# EAGLE schematic esplash (EAGLE 9.2.2)
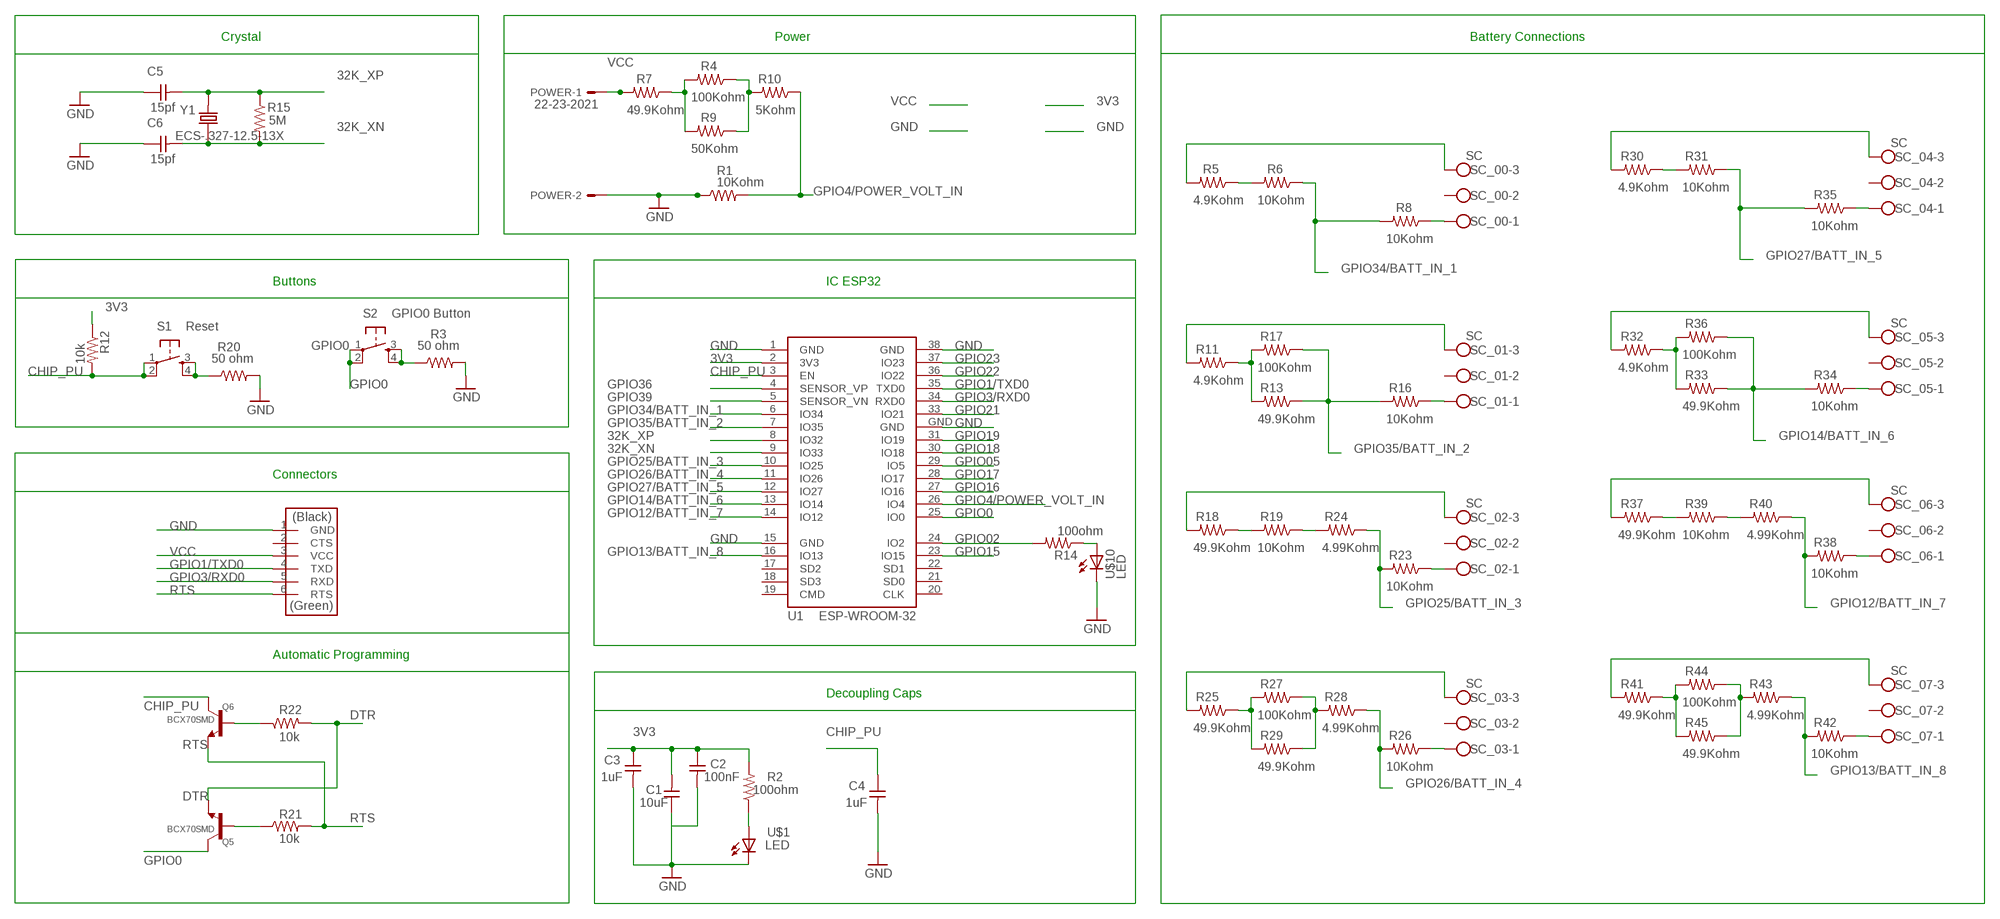
[diagram p0: schematic, sheet 1]

## Parts
C1  10uF  CAP-UNPOLARIZEDFAB  [C1206FAB]
C2  100nF  CAP-UNPOLARIZEDFAB  [C1206FAB]
C3  1uF  CAP-UNPOLARIZEDFAB  [C1206FAB]
C4  1uF  CAP-UNPOLARIZEDFAB  [C1206FAB]
C5  15pf  CAP-UNPOLARIZEDFAB  [C1206FAB]
C6  15pf  CAP-UNPOLARIZEDFAB  [C1206FAB]
POWER  22-23-2021  [22-23-2021]
Q5  BCX70SMD  [SOT23]
Q6  BCX70SMD  [SOT23]
R1  10Kohm  RES-US1206FAB  [R1206FAB]
R2  100ohm  RES-US1206  [R1206]
R3  50 ohm  RES-US1206  [R1206]
R4  100Kohm  RES-US1206FAB  [R1206FAB]
R5  4.9Kohm  RES-US1206FAB  [R1206FAB]
R6  10Kohm  RES-US1206FAB  [R1206FAB]
R7  49.9Kohm  RES-US1206FAB  [R1206FAB]
R8  10Kohm  RES-US1206FAB  [R1206FAB]
R9  50Kohm  RES-US1206FAB  [R1206FAB]
R10  5Kohm  RES-US1206FAB  [R1206FAB]
R11  4.9Kohm  RES-US1206FAB  [R1206FAB]
R12  10k  RES-US1206  [R1206]
R13  49.9Kohm  RES-US1206FAB  [R1206FAB]
R14  100ohm  RES-US1206  [R1206]
R15  5M  RES-US1206  [R1206]
R16  10Kohm  RES-US1206FAB  [R1206FAB]
R17  100Kohm  RES-US1206FAB  [R1206FAB]
R18  49.9Kohm  RES-US1206FAB  [R1206FAB]
R19  10Kohm  RES-US1206FAB  [R1206FAB]
R20  50 ohm  RES-US1206  [R1206]
R21  10k  RES-US1206  [R1206]
R22  10k  RES-US1206  [R1206]
R23  10Kohm  RES-US1206FAB  [R1206FAB]
R24  4.99Kohm  RES-US1206FAB  [R1206FAB]
R25  49.9Kohm  RES-US1206FAB  [R1206FAB]
R26  10Kohm  RES-US1206FAB  [R1206FAB]
R27  100Kohm  RES-US1206FAB  [R1206FAB]
R28  4.99Kohm  RES-US1206FAB  [R1206FAB]
R29  49.9Kohm  RES-US1206FAB  [R1206FAB]
R30  4.9Kohm  RES-US1206FAB  [R1206FAB]
R31  10Kohm  RES-US1206FAB  [R1206FAB]
R32  4.9Kohm  RES-US1206FAB  [R1206FAB]
R33  49.9Kohm  RES-US1206FAB  [R1206FAB]
R34  10Kohm  RES-US1206FAB  [R1206FAB]
R35  10Kohm  RES-US1206FAB  [R1206FAB]
R36  100Kohm  RES-US1206FAB  [R1206FAB]
R37  49.9Kohm  RES-US1206FAB  [R1206FAB]
R38  10Kohm  RES-US1206FAB  [R1206FAB]
R39  10Kohm  RES-US1206FAB  [R1206FAB]
R40  4.99Kohm  RES-US1206FAB  [R1206FAB]
R41  49.9Kohm  RES-US1206FAB  [R1206FAB]
R42  10Kohm  RES-US1206FAB  [R1206FAB]
R43  4.99Kohm  RES-US1206FAB  [R1206FAB]
R44  100Kohm  RES-US1206FAB  [R1206FAB]
R45  49.9Kohm  RES-US1206FAB  [R1206FAB]
RTS  FTDI-SMD-HEADER  [1X06SMD]
S1  Reset  6MM_SWITCH6MM_SWITCH  [6MM_SWITCH]
S2  GPIO0 Button  6MM_SWITCH6MM_SWITCH  [6MM_SWITCH]
SC_00  SC  W237-103  [W237-103]
SC_01  SC  W237-103  [W237-103]
SC_02  SC  W237-103  [W237-103]
SC_03  SC  W237-103  [W237-103]
SC_04  SC  W237-103  [W237-103]
SC_05  SC  W237-103  [W237-103]
SC_06  SC  W237-103  [W237-103]
SC_07  SC  W237-103  [W237-103]
U1  ESP-WROOM-32  [ESP-WROOM-32]
U$1  LED  [LED1206]
U$10  LED  [LED1206]
Y1  ECS-.327-12.5-13X  [XTAL_ECS-.327-12.5-13X]

## Nets
3V3: C1.2 C2.1 C3.1 R2.2 R12.1 U1.2(3V3)
32K_XN: C6.2 R15.2 U1.9(IO33) Y1.1
32K_XP: C5.2 R15.1 U1.8(IO32) Y1.2
BUT_CHIP_LO: R20.1 S1.3(S) S1.4(S1)
BUT_IO0_LO: R3.1 S2.3(S) S2.4(S1)
CHIP_PU: C4.1 Q6.3(C) R12.2 S1.1(P) S1.2(P1) U1.3(EN)
DTR: Q5.2(E) R22.2
GND: C1.1 C2.2 C3.2 C4.2 C5.1 C6.1 POWER.2 R1.1 R3.2 R20.2 RTS.1(GND) U1.1(GND) U1.15(GND) U1.38(GND) U1.GND U$1.2(C) U$10.2(C)
GPIO0: Q5.3(C) S2.1(P) S2.2(P1) U1.25(IO0)
GPIO1/TXD0: RTS.4(TXD) U1.35(TXD0)
GPIO02: R14.2 U1.24(IO2)
GPIO3/RXD0: RTS.5(RXD) U1.34(RXD0)
GPIO4/POWER_VOLT_IN: R1.2 R10.1 U1.26(IO4)
GPIO05: U1.29(IO5)
GPIO12/BATT_IN_7: R38.2 R40.1 U1.14(IO12)
GPIO13/BATT_IN_8: R42.2 R43.1 U1.16(IO13)
GPIO14/BATT_IN_6: R33.1 R34.2 R36.1 U1.13(IO14)
GPIO15: U1.23(IO15)
GPIO16: U1.27(IO16)
GPIO17: U1.28(IO17)
GPIO18: U1.30(IO18)
GPIO19: U1.31(IO19)
GPIO21: U1.33(IO21)
GPIO22: U1.36(IO22)
GPIO23: U1.37(IO23)
GPIO25/BATT_IN_3: R23.2 R24.1 U1.10(IO25)
GPIO26/BATT_IN_4: R26.2 R28.1 U1.11(IO26)
GPIO27/BATT_IN_5: R31.1 R35.2 U1.12(IO27)
GPIO34/BATT_IN_1: R6.1 R8.2 U1.6(IO34)
GPIO35/BATT_IN_2: R13.1 R16.2 R17.1 U1.7(IO35)
GPIO36: U1.4(SENSOR_VP)
GPIO39: U1.5(SENSOR_VN)
N$2: R2.1 U$1.1(A)
N$3: R4.2 R7.1 R9.2
N$5: R4.1 R9.1 R10.2
N$6: R5.1 R6.2
N$7: R18.2 SC_02.3
N$8: R16.1 SC_01.1
N$10: R14.1 U$10.1(A)
N$12: R5.2 SC_00.3
N$13: R8.1 SC_00.1
N$14: R11.2 SC_01.3
N$15: R11.1 R13.2 R17.2
N$16: R23.1 SC_02.1
N$17: R18.1 R19.2
N$18: R19.1 R24.2
N$19: R25.2 SC_03.3
N$20: R25.1 R27.2 R29.2
N$21: R26.1 SC_03.1
N$22: R27.1 R28.2 R29.1
N$23: R30.1 R31.2
N$24: R30.2 SC_04.3
N$25: R32.2 SC_05.3
N$26: Q5.1(B) R21.1
N$27: R34.1 SC_05.1
N$28: R35.1 SC_04.1
N$29: R32.1 R33.2 R36.2
N$30: R37.2 SC_06.3
N$31: R37.1 R39.2
N$32: R38.1 SC_06.1
N$33: R39.1 R40.2
N$34: Q6.1(B) R22.1
N$35: R41.2 SC_07.3
N$36: R41.1 R44.2 R45.2
N$37: R43.2 R44.1 R45.1
N$38: R42.1 SC_07.1
RTS: Q6.2(E) R21.2 RTS.6(RTS)
VCC: POWER.1 R7.2 RTS.3(VCC)
Unconnected: RTS.2(CTS) SC_00.2 SC_01.2 SC_02.2 SC_03.2 SC_04.2 SC_05.2 SC_06.2 SC_07.2 U1.17(SD2) U1.18(SD3) U1.19(CMD) U1.20(CLK) U1.21(SD0) U1.22(SD1)

## Notes on the sheet
- Crystal | Power | Battery Connections
- Buttons | IC ESP32
- Connectors
- Automatic Programming
- Decoupling Caps

## Library data of the parts
C1-C6 = fab:CAP-UNPOLARIZED
POWER = con-molex:22-23-2021: .100" (2.54mm) Center Header - 2 Pin; MF: MOLEX; MPN: 22-23-2021; OC_FARNELL: 1462926; OC_NEWARK: 25C3832
Q5 Q6 = transistor:BCX70SMD: NPN TRANSISTOR
R1-R45 = fab:RES-US: Resistor (US Symbol) Variants with postfix FAB are widened to allow the routing of internal traces
RTS = fab:FTDI-SMD-HEADER
S1 S2 = fab:6MM_SWITCH: OMRON SWITCH
SC_00 SC_01-SC_07 = con-wago-500:W237-103: WAGO SCREW CLAMP; MPN: 237-103; OC_FARNELL: unknown; OC_NEWARK: 18M7116
U1 = esp32:ESP-WROOM-32: Espressif Systems ESP-WROOM-32
U$1 U$10 = fab:LED: LED
Y1 = ECS-.327-12.5-13X:ECS-.327-12.5-13X: Crystal Cylindrical Can, Radial; AVAILABILITY: Unavailable; DESCRIPTION: 32.768kHz ±20ppm Crystal 12.5pF 35 kOhms Cylindrical Can, Radial; MF: ECS Inc.; MP: ECS-.327-12.5-13X; PACKAGE: Cylindrical Can Radial ECS International; PRICE: None